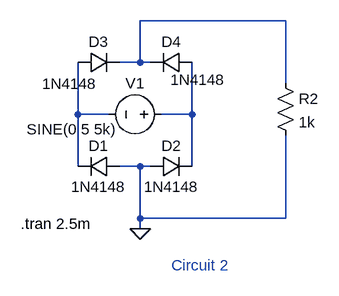
[diagram p0: schematic 5.2 - circuit2.asc]
5.2 - circuit2.asc, the LTspice schematic file:
Version 4
SHEET 1 1064 680
WIRE 640 -16 416 -16
WIRE 416 48 416 -16
WIRE 416 48 384 48
WIRE 432 48 416 48
WIRE 640 80 640 -16
WIRE 320 128 320 48
WIRE 368 128 320 128
WIRE 496 128 496 48
WIRE 496 128 448 128
WIRE 320 208 320 128
WIRE 416 208 384 208
WIRE 432 208 416 208
WIRE 496 208 496 128
WIRE 416 288 416 208
WIRE 640 288 640 160
WIRE 640 288 416 288
WIRE 416 304 416 288
FLAG 416 304 0
SYMBOL voltage 464 128 R90
WINDOW 0 -32 56 VBottom 2
WINDOW 3 7 154 VTop 2
WINDOW 123 0 0 Left 0
WINDOW 39 0 0 Left 0
SYMATTR InstName V1
SYMATTR Value SINE(0 5 5k)
SYMBOL diode 384 192 R90
WINDOW 0 0 32 VBottom 2
WINDOW 3 32 32 VTop 2
SYMATTR InstName D1
SYMATTR Value 1N4148
SYMBOL diode 432 224 R270
WINDOW 0 32 32 VTop 2
WINDOW 3 0 32 VBottom 2
SYMATTR InstName D2
SYMATTR Value 1N4148
SYMBOL diode 320 64 R270
WINDOW 0 32 32 VTop 2
WINDOW 3 -1 -13 VBottom 2
SYMATTR InstName D3
SYMATTR Value 1N4148
SYMBOL diode 496 32 R90
WINDOW 0 0 32 VBottom 2
WINDOW 3 27 -9 VTop 2
SYMATTR InstName D4
SYMATTR Value 1N4148
SYMBOL res 624 64 R0
SYMATTR InstName R2
SYMATTR Value 1k
TEXT 232 296 Left 2 !.tran 2.5m
TEXT 464 360 Left 2 ;Circuit 2

The netlist it stands for:
* 5.2 - circuit2.asc
V1 N003 N002 SINE(0 5 5k)
D1 0 N002 1N4148
D2 0 N003 1N4148
D3 N002 N001 1N4148
D4 N003 N001 1N4148
R2 N001 0 1k
.model D D
.lib standard.dio
.tran 2.5m
* Circuit 2
.backanno
.end